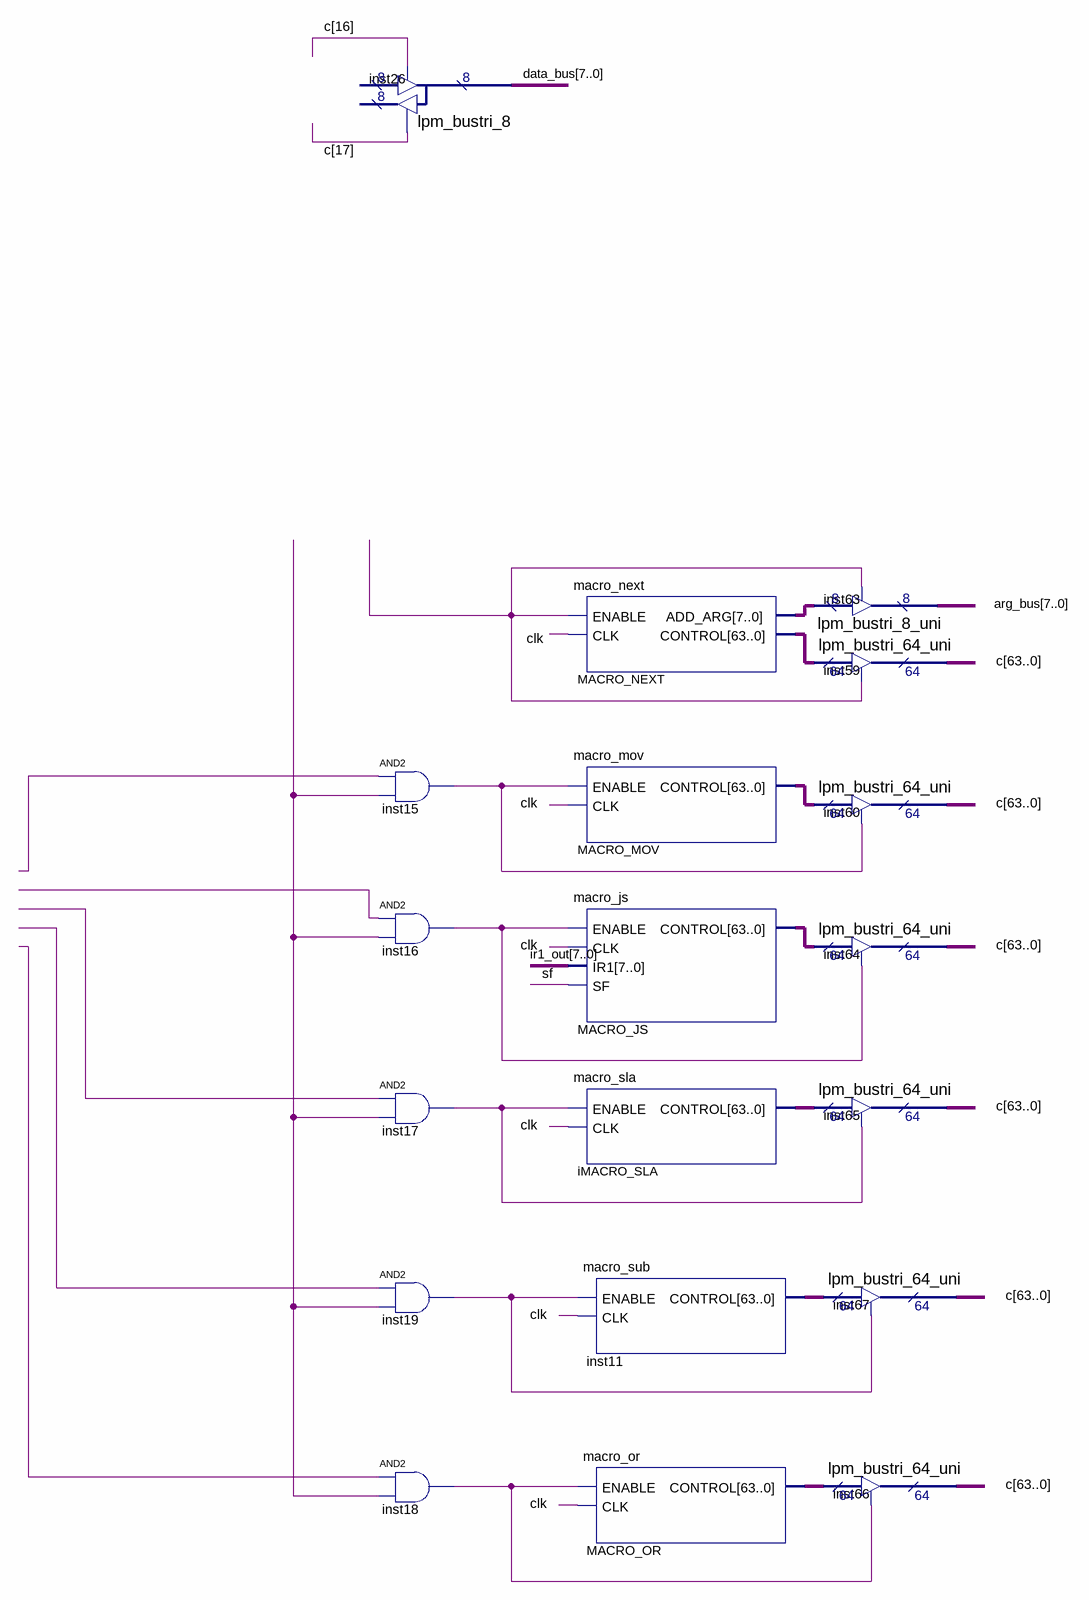
[diagram p0: schematic sheet]
// Quartus schematic parts.bdf as structural Verilog: 19 symbols, 0 pins
module parts (
);

  wire clk, inst15_out, inst16_out, inst17_out, inst18_out, inst19_out, sf, undriven, undriven_2, undriven_3,
       undriven_4, undriven_5, undriven_6, undriven_7;
  wire [7:0] arg_bus, data_bus, ir1_out, MACRO_NEXT_add_arg;
  wire [63:0] c, iMACRO_SLA_control, inst11_control, MACRO_JS_control, MACRO_MOV_control, MACRO_NEXT_control,
       MACRO_OR_control;

  lpm_bustri_8 inst26 (.enabledt(c[16]), .enabletr(c[17]), .tridata(data_bus));  // open: data, result
  and inst15 (inst15_out, undriven, undriven_6);
  and inst16 (inst16_out, undriven_2, undriven_6);
  and inst17 (inst17_out, undriven_3, undriven_6);
  and inst19 (inst19_out, undriven_5, undriven_6);
  and inst18 (inst18_out, undriven_4, undriven_6);
  macro_next MACRO_NEXT (.ENABLE(undriven_7), .CLK(clk), .ADD_ARG(MACRO_NEXT_add_arg), .CONTROL(MACRO_NEXT_control));
  macro_mov MACRO_MOV (.ENABLE(inst15_out), .CLK(clk), .CONTROL(MACRO_MOV_control));
  macro_js MACRO_JS (.ENABLE(inst16_out), .CLK(clk), .IR1(ir1_out), .SF(sf), .CONTROL(MACRO_JS_control));
  macro_sla iMACRO_SLA (.ENABLE(inst17_out), .CLK(clk), .CONTROL(iMACRO_SLA_control));
  macro_sub inst11 (.ENABLE(inst19_out), .CLK(clk), .CONTROL(inst11_control));
  macro_or MACRO_OR (.ENABLE(inst18_out), .CLK(clk), .CONTROL(MACRO_OR_control));
  lpm_bustri_8_uni inst63 (.enabledt(undriven_7), .data(MACRO_NEXT_add_arg), .tridata(arg_bus));
  lpm_bustri_64_uni inst59 (.enabledt(undriven_7), .data(MACRO_NEXT_control), .tridata(c));
  lpm_bustri_64_uni inst60 (.enabledt(inst15_out), .data(MACRO_MOV_control), .tridata(c));
  lpm_bustri_64_uni inst64 (.enabledt(inst16_out), .data(MACRO_JS_control), .tridata(c));
  lpm_bustri_64_uni inst65 (.enabledt(inst17_out), .data(iMACRO_SLA_control), .tridata(c));
  lpm_bustri_64_uni inst67 (.enabledt(inst19_out), .data(inst11_control), .tridata(c));
  lpm_bustri_64_uni inst66 (.enabledt(inst18_out), .data(MACRO_OR_control), .tridata(c));
endmodule
